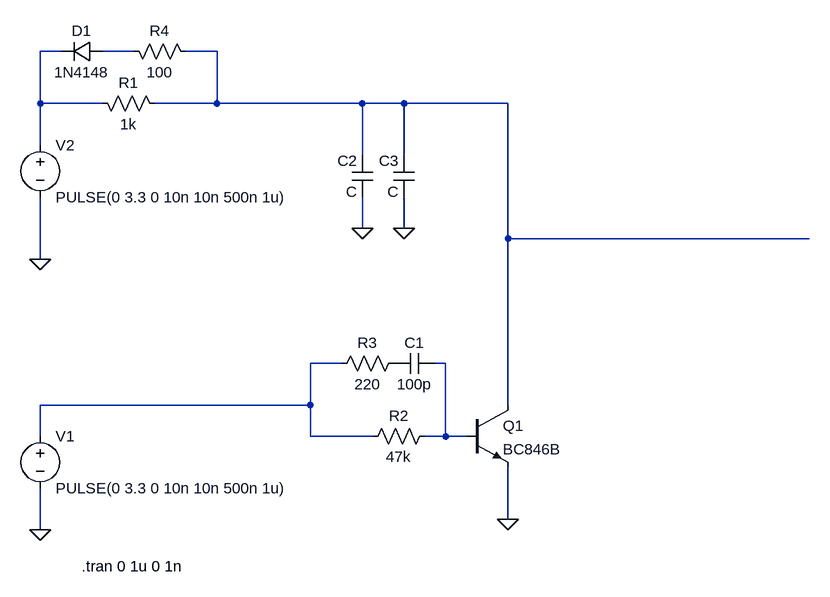
[diagram p0: schematic Verriegelung.asc]
Verriegelung.asc, the LTspice schematic file:
Version 4
SHEET 1 1192 680
WIRE -384 -224 -416 -224
WIRE -272 -224 -320 -224
WIRE -144 -224 -192 -224
WIRE -416 -144 -416 -224
WIRE -320 -144 -416 -144
WIRE -144 -144 -144 -224
WIRE -144 -144 -240 -144
WIRE 80 -144 -144 -144
WIRE 144 -144 80 -144
WIRE 304 -144 144 -144
WIRE -416 -80 -416 -144
WIRE 80 -64 80 -144
WIRE 144 -64 144 -144
WIRE 80 48 80 0
WIRE 144 48 144 0
WIRE 304 64 304 -144
WIRE 768 64 304 64
WIRE -416 96 -416 0
WIRE 48 256 0 256
WIRE 208 256 192 256
WIRE 0 320 0 256
WIRE 0 320 -416 320
WIRE 304 320 304 64
WIRE -416 368 -416 320
WIRE 0 368 0 320
WIRE 96 368 0 368
WIRE 208 368 208 256
WIRE 208 368 176 368
WIRE 240 368 208 368
WIRE 304 496 304 416
WIRE -416 512 -416 448
FLAG -416 512 0
FLAG -416 96 0
FLAG 304 496 0
FLAG 80 48 0
FLAG 144 48 0
SYMBOL voltage -416 352 R0
WINDOW 123 0 0 Left 0
WINDOW 39 0 0 Left 0
SYMATTR InstName V1
SYMATTR Value PULSE(0 3.3 0 10n 10n 500n 1u)
SYMBOL res -336 -160 M90
WINDOW 0 0 56 VBottom 2
WINDOW 3 32 56 VTop 2
SYMATTR InstName R1
SYMATTR Value 1k
SYMBOL res 192 352 R90
WINDOW 0 0 56 VBottom 2
WINDOW 3 32 56 VTop 2
SYMATTR InstName R2
SYMATTR Value 47k
SYMBOL npn 240 320 R0
SYMATTR InstName Q1
SYMATTR Value BC846B
SYMBOL cap 192 240 R90
WINDOW 0 0 32 VBottom 2
WINDOW 3 32 32 VTop 2
SYMATTR InstName C1
SYMATTR Value 100p
SYMBOL res 144 240 R90
WINDOW 0 0 56 VBottom 2
WINDOW 3 32 56 VTop 2
SYMATTR InstName R3
SYMATTR Value 220
SYMBOL cap 96 -64 M0
SYMATTR InstName C2
SYMBOL diode -320 -208 M270
WINDOW 0 32 32 VTop 2
WINDOW 3 0 32 VBottom 2
SYMATTR InstName D1
SYMATTR Value 1N4148
SYMBOL res -288 -240 M90
WINDOW 0 0 56 VBottom 2
WINDOW 3 32 56 VTop 2
SYMATTR InstName R4
SYMATTR Value 100
SYMBOL cap 160 -64 M0
SYMATTR InstName C3
SYMBOL voltage -416 -96 R0
WINDOW 123 0 0 Left 0
WINDOW 39 0 0 Left 0
SYMATTR InstName V2
SYMATTR Value PULSE(0 3.3 0 10n 10n 500n 1u)
TEXT -352 568 Left 2 !.tran 0 1u 0 1n

The netlist it stands for:
* Verriegelung.asc
V1 N004 0 PULSE(0 3.3 0 10n 10n 500n 1u)
R1 N001 N003 1k
R2 N005 N004 47k
Q1 N003 N005 0 0 BC846B
C1 N005 P001 100p
R3 P001 N004 220
C2 N003 0 C
D1 N002 N001 1N4148
R4 N002 N003 100
C3 N003 0 C
V2 N001 0 PULSE(0 3.3 0 10n 10n 500n 1u)
.model D D
.lib standard.dio
.model NPN NPN
.model PNP PNP
.lib standard.bjt
.tran 0 1u 0 1n
.backanno
.end